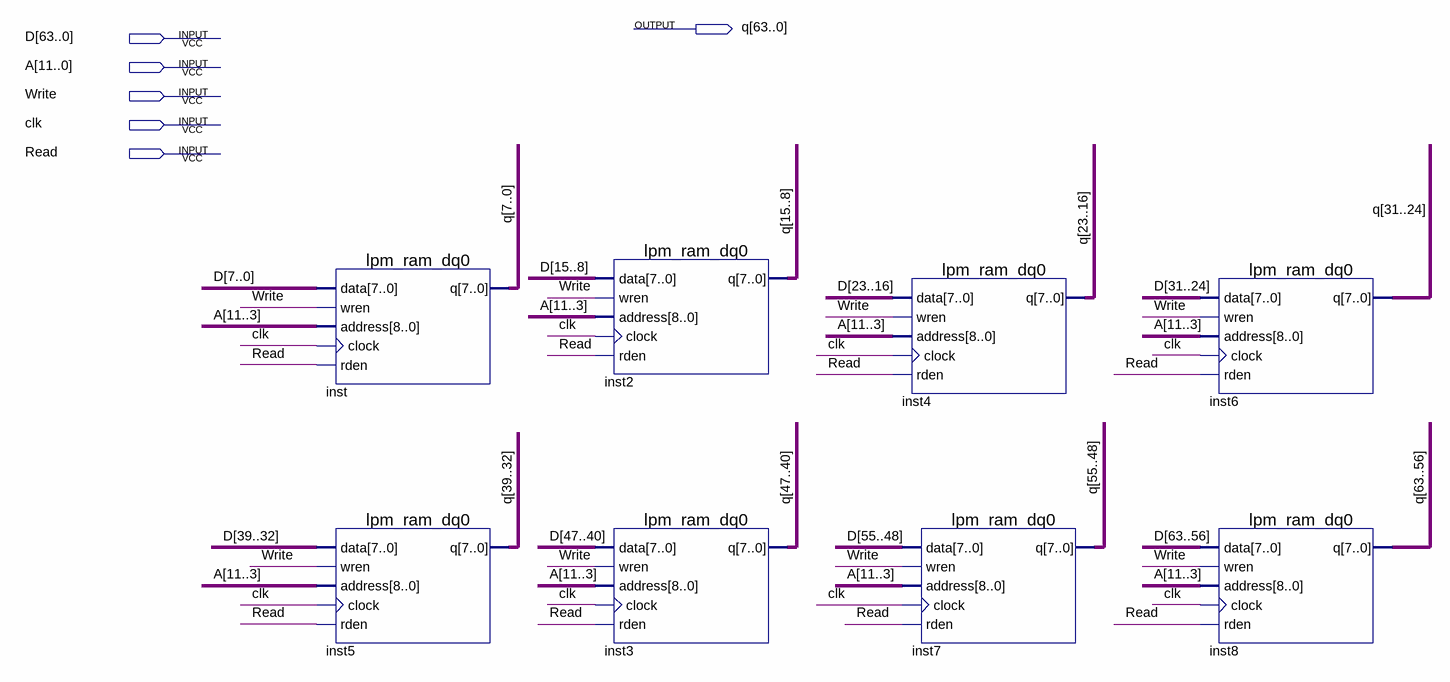
[diagram p0: schematic sheet]
// Quartus schematic DMEM.bdf as structural Verilog: 8 symbols, 6 pins
module DMEM (
  input  [63:0] D,
  input  [11:0] A,
  input  Write,
  input  clk,
  input  Read,
  output [63:0] q
);

  lpm_ram_dq0 inst (.data(D[7:0]), .wren(Write), .address(A[11:3]), .clock(clk), .rden(Read), .q(q[7:0]));
  lpm_ram_dq0 inst5 (.data(D[39:32]), .wren(Write), .address(A[11:3]), .clock(clk), .rden(Read), .q(q[39:32]));
  lpm_ram_dq0 inst2 (.data(D[15:8]), .wren(Write), .address(A[11:3]), .clock(clk), .rden(Read), .q(q[15:8]));
  lpm_ram_dq0 inst3 (.data(D[47:40]), .wren(Write), .address(A[11:3]), .clock(clk), .rden(Read), .q(q[47:40]));
  lpm_ram_dq0 inst4 (.data(D[23:16]), .wren(Write), .address(A[11:3]), .clock(clk), .rden(Read), .q(q[23:16]));
  lpm_ram_dq0 inst7 (.data(D[55:48]), .wren(Write), .address(A[11:3]), .clock(clk), .rden(Read), .q(q[55:48]));
  lpm_ram_dq0 inst6 (.data(D[31:24]), .wren(Write), .address(A[11:3]), .clock(clk), .rden(Read), .q(q[31:24]));
  lpm_ram_dq0 inst8 (.data(D[63:56]), .wren(Write), .address(A[11:3]), .clock(clk), .rden(Read), .q(q[63:56]));
endmodule
